# Altium schematic sheet LSM6DSRXTR.SchDoc
size A4; SheetNumber: 5; SheetTotal: 11
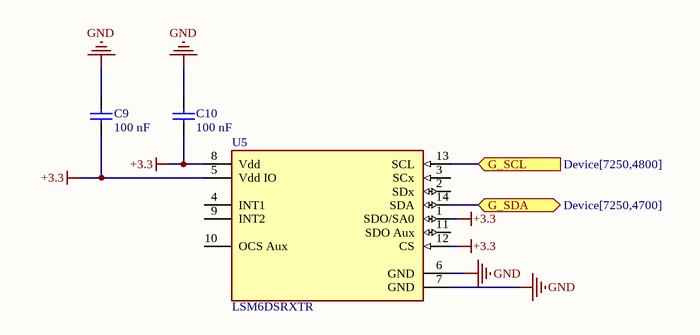
[diagram p0: LSM6DSRXTR.SchDoc]

## Parts
C9  100 nF  [CAPC1005X55X25NL05T10]
C10  100 nF  [CAPC1005X55X25NL05T10]
U5  LSM6DSRXTR  [FP-LGA-14L-DM00249496-MFG]

## Ports
G_SCL (in, see Device[7250,4800]), G_SDA (bidir, see Device[7250,4700])

## Nets
+3.3: C9.2 C10.2 U5.1(SDO/SA0) U5.5(Vdd_IO) U5.8(Vdd) U5.12(CS)
GND: C9.1 C10.1 U5.6(GND) U5.7(GND)
G_SCL: U5.13(SCL) ; port G_SCL
G_SDA: U5.14(SDA) ; port G_SDA

Not connected (* = marked no-connect by the designer): U5 2(SDx) 3(SCx) 4(INT1) 9(INT2) 10(OCS_Aux) 11(SDO_Aux)

## Library data of the parts
C9 C10 = CMP-2008-04515-1: Manufacturer: Murata; Part Number: GRM155F50J684ZE01D
U5 = CMP-12177-000016-1: CONSUMER MEMS; RoHS Compliant: Yes